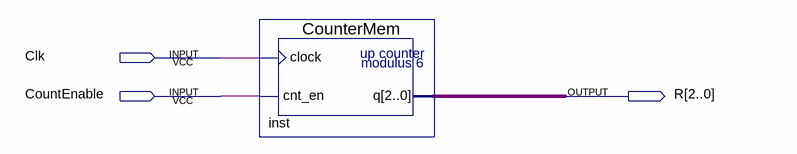
[diagram p0: schematic sheet]
// Quartus schematic TesteCounter.bdf as structural Verilog: 1 symbols, 3 pins
module TesteCounter (
  input  Clk,
  input  CountEnable,
  output [2:0] R
);

  CounterMem inst (.clock(Clk), .cnt_en(CountEnable), .q(R));
endmodule
